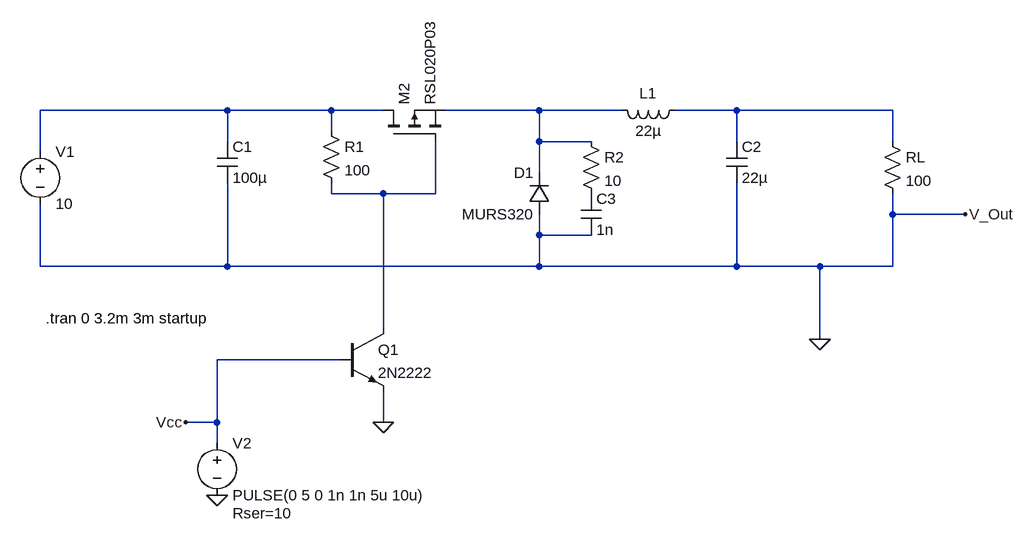
[diagram p0: schematic Buck_Converter.asc]
Buck_Converter.asc, the LTspice schematic file:
Version 4.1
SHEET 1 1576 892
WIRE 320 144 32 144
WIRE 480 144 320 144
WIRE 560 144 480 144
WIRE 800 144 656 144
WIRE 928 144 800 144
WIRE 1104 144 1008 144
WIRE 1344 144 1104 144
WIRE 480 176 480 144
WIRE 320 192 320 144
WIRE 800 192 800 144
WIRE 880 192 800 192
WIRE 1104 192 1104 144
WIRE 1344 192 1344 144
WIRE 32 208 32 144
WIRE 800 240 800 192
WIRE 480 272 480 256
WIRE 560 272 480 272
WIRE 640 272 640 192
WIRE 640 272 560 272
WIRE 1344 304 1344 272
WIRE 1456 304 1344 304
WIRE 800 336 800 304
WIRE 880 336 800 336
WIRE 32 384 32 288
WIRE 320 384 320 256
WIRE 320 384 32 384
WIRE 800 384 800 336
WIRE 800 384 320 384
WIRE 1104 384 1104 256
WIRE 1104 384 800 384
WIRE 1232 384 1104 384
WIRE 1344 384 1344 304
WIRE 1344 384 1232 384
WIRE 560 480 560 272
WIRE 1232 496 1232 384
WIRE 496 528 304 528
WIRE 304 624 304 528
WIRE 304 624 256 624
WIRE 560 624 560 576
WIRE 304 656 304 624
FLAG 1232 496 0
FLAG 560 624 0
FLAG 304 736 0
FLAG 1456 304 V_Out
FLAG 256 624 Vcc
SYMBOL voltage 32 192 R0
WINDOW 123 0 0 Left 0
WINDOW 39 0 0 Left 0
SYMATTR InstName V1
SYMATTR Value 10
SYMBOL cap 304 192 R0
SYMATTR InstName C1
SYMATTR Value 100µ
SYMBOL res 464 160 R0
SYMATTR InstName R1
SYMATTR Value 100
SYMBOL diode 816 304 R180
WINDOW 0 24 64 Left 2
WINDOW 3 24 0 Left 2
SYMATTR InstName D1
SYMATTR Value MURS320
SYMBOL ind 1024 128 R90
WINDOW 0 5 56 VBottom 2
WINDOW 3 32 56 VTop 2
SYMATTR InstName L1
SYMATTR Value 22µ
SYMATTR SpiceLine Rser=1m
SYMBOL cap 1088 192 R0
SYMATTR InstName C2
SYMATTR Value 22µ
SYMBOL res 1328 176 R0
SYMATTR InstName RL
SYMATTR Value 100
SYMBOL npn 496 480 R0
SYMATTR InstName Q1
SYMATTR Value 2N2222
SYMBOL voltage 304 640 R0
WINDOW 123 0 0 Left 0
WINDOW 39 24 124 Left 2
SYMATTR InstName V2
SYMATTR Value PULSE(0 5 0 1n 1n 5u 10u)
SYMATTR SpiceLine Rser=10
SYMBOL pmos 560 192 R270
SYMATTR InstName M2
SYMATTR Value RSL020P03
SYMBOL res 864 176 R0
SYMATTR InstName R2
SYMATTR Value 10
SYMBOL cap 864 272 R0
SYMATTR InstName C3
SYMATTR Value 1n
TEXT 40 464 Left 2 !.tran 0 3.2m 3m startup

The netlist it stands for:
* Buck_Converter.asc
V1 N001 0 10
C1 N001 0 100µ
R1 N001 N004 100
D1 0 N002 MURS320
L1 N003 N002 22µ Rser=1m
C2 N003 0 22µ
RL N003 0 100
Q1 N004 Vcc 0 0 2N2222
V2 Vcc 0 PULSE(0 5 0 1n 1n 5u 10u) Rser=10
M2 N001 N004 N002 N002 RSL020P03
R2 N002 P001 10
C3 P001 0 1n
.model D D
.lib standard.dio
.model NPN NPN
.model PNP PNP
.lib standard.bjt
.model NMOS NMOS
.model PMOS PMOS
.lib standard.mos
.tran 0 3.2m 3m startup
.backanno
.end